# Altium schematic sheet Sheet1.SchDoc
size A4
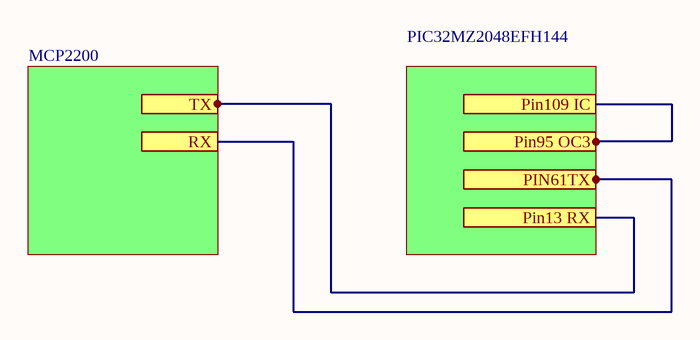
[diagram p0: Sheet1.SchDoc]

## Sub-sheets
PIC32MZ2048EFH144 = ?: Pin95 OC3, PIN61TX
? = MCP2200: RX

## Ports
Pin13 RX, PIN61TX, Pin95 OC3, Pin109 IC, RX, TX

## Nets
Pin13 RX: port TX, port Pin13 RX, sheet /RX
PIN61TX: port RX, port PIN61TX, sheet PIC32MZ2048EFH144/PIN61TX
Pin109 IC: port Pin109 IC, port Pin95 OC3, sheet PIC32MZ2048EFH144/Pin95 OC3